# Altium schematic sheet I_DC_Buffering.SchDoc
size A4
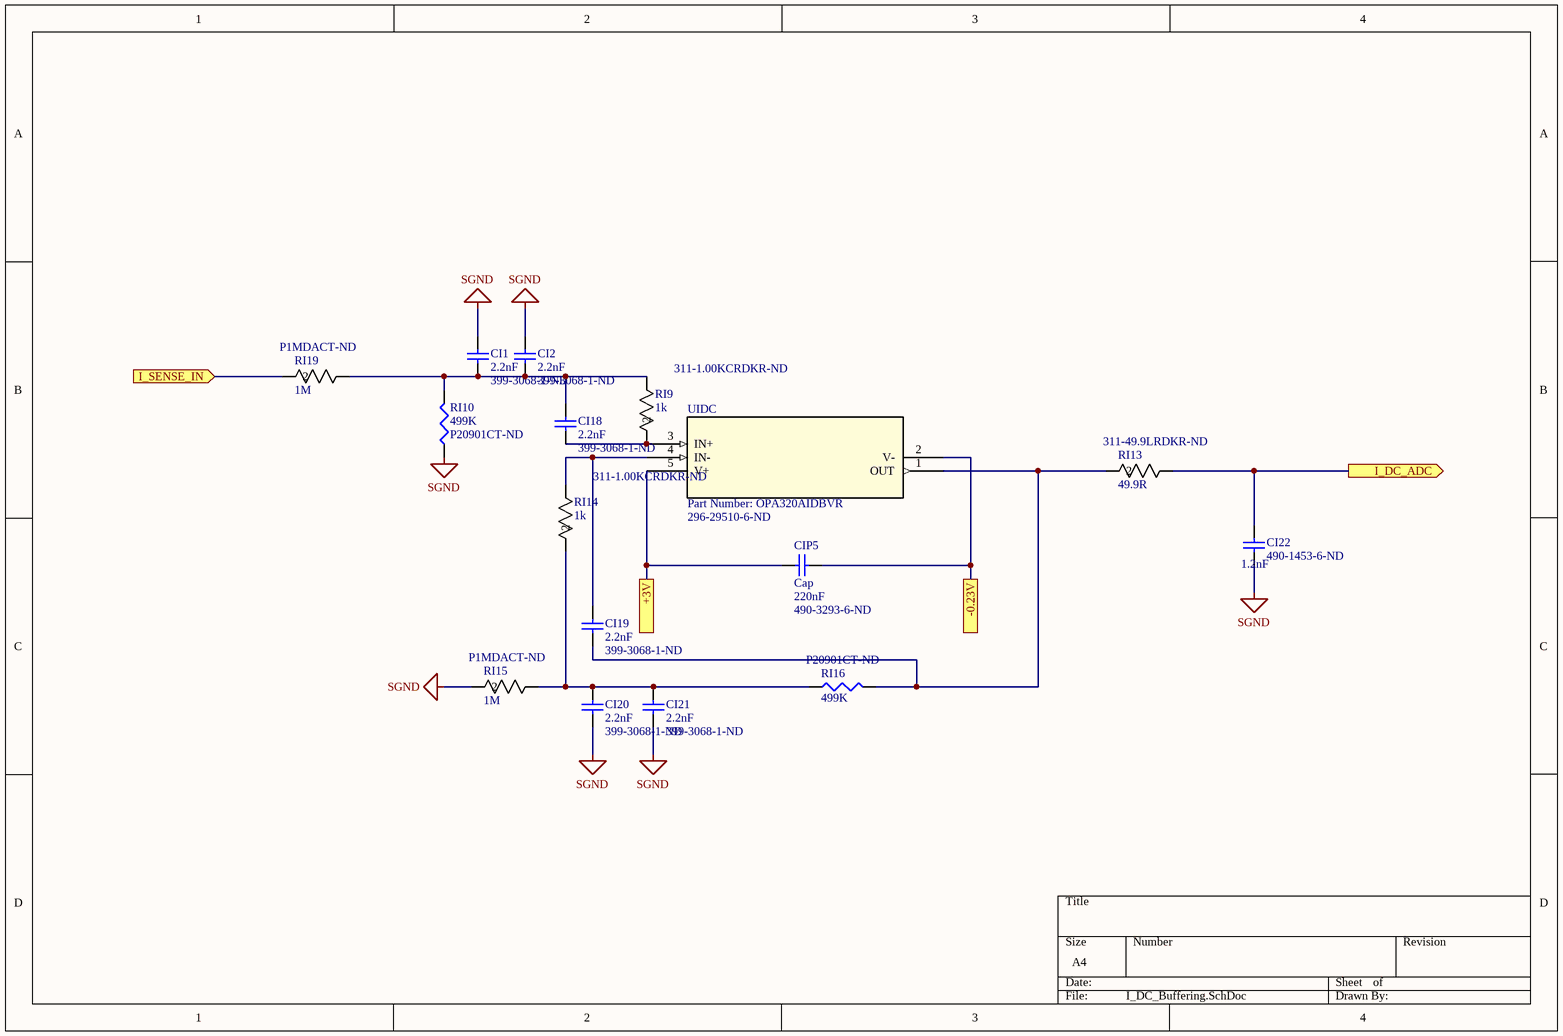
[diagram p0: I_DC_Buffering.SchDoc]

## Parts
CI1  2.2nF  Supplier Part Number 1: 399-3068-1-ND  [0402]
CI2  2.2nF  Supplier Part Number 1: 399-3068-1-ND  [0402]
CI18  2.2nF  Supplier Part Number 1: 399-3068-1-ND  [0402]
CI19  2.2nF  Supplier Part Number 1: 399-3068-1-ND  [0402]
CI20  2.2nF  Supplier Part Number 1: 399-3068-1-ND  [0402]
CI21  2.2nF  Supplier Part Number 1: 399-3068-1-ND  [0402]
CI22  1.2nF  Supplier Part Number 1: 490-1453-6-ND  [G-188]
CIP5  Cap  value 220nF  Supplier Part Number 1: 490-3293-6-ND  [G-188]
RI9  1k  Supplier Part Number 1: 311-1.00KCRDKR-ND  [RC0805N]
RI10  499K  Supplier Part Number 1: P20901CT-ND  [6-0805_N]
RI13  49.9R  Supplier Part Number 1: 311-49.9LRDKR-ND  [RC0402N]
RI14  1k  Supplier Part Number 1: 311-1.00KCRDKR-ND  [RC0805N]
RI15  1M  Supplier Part Number 1: P1MDACT-ND  [RC0805N]
RI16  499K  Supplier Part Number 1: P20901CT-ND  [6-0805_N]
RI19  1M  Supplier Part Number 1: P1MDACT-ND  [RC0805N]
UIDC  Part Number: OPA320AIDBVR  Supplier Part Number 1: 296-29510-6-ND  [DBV5]

## Ports
+3V, -0.23V, I_DC_ADC (out), I_SENSE_IN (in)

## Nets
SGND: CI1.2 CI2.2 CI20.2 CI21.2 CI22.2 RI10.1 RI15.2
+3V: CIP5.2 UIDC.5(V+) ; port +3V
-0.23V: CIP5.1 UIDC.2(V-) ; port -0.23V
I_DC_ADC: CI22.1 RI13.1 ; port I_DC_ADC
I_SENSE_IN: RI19.2 ; port I_SENSE_IN
NetCI1_1: CI1.1 CI2.1 CI18.1 RI9.1 RI10.2 RI19.1
NetCI18_2: CI18.2 RI9.2 UIDC.3(IN+)
NetCI19_1: CI19.1 RI14.1 UIDC.4(IN-)
NetCI19_2: CI19.2 RI13.2 RI16.2 UIDC.1(OUT)
NetCI20_1: CI20.1 CI21.1 RI14.2 RI15.1 RI16.1

## Library data of the parts
CI1 CI2 CI18-CI21 = Cap Semi: Manufacturer: KEMET; Manufacturer Part Number: C0402C222K5RACTU; Dielectric Material: Ceramic; Tolerance: 10%; Dielectric: X7R; Voltage Rating (DC): 50V; Published: 8-Jun-2000; LatestRevisionDate: 29-May-2009; LatestRevisionNote: IPC-7351 Footprint Added.; PackageReference: C1206; Publisher: Altium Limited; PackageDescription: Chip Capacitor; Supplier 1: Digi-Key; Stock 1: 1736920; Pricing 1: 1=0.1, 10=0.033, 100=0.0147, 500=0.01046, 1000=0.00822, 2500=0.00748, 5000=0.00688 (USD); Mount: Surface Mount; Case/Package: 0402; Min Operating Temperature: -55°C; Max Operating Temperature: 125°C; Capacitance: 2.2nF; Packaging: Tape and Reel; Voltage: 50V; Termination: SMD/SMT; Length: 1mm; Height: 0.5mm; Depth: 0.5mm; Radiation Hardening: No; ComponentLink1URL: http://www.onlinecomponents.com/productFiles/mf-KEM/docfinderpartnumberc0402c102k5ractu.pdf?src-supplier=Onlinecomponents.com; ComponentLink1Description: http://www.onlinecomponents.com/productFiles/mf-KEM/docfinderpartnumberc0402c102k5ractu.pdf?src-supplier=Onlinecomponents.com
CI22 = 1004001100050: Manufacturer: Murata; Manufacturer Part Number: GRM1885C1H122JA01D; Tolerance: 5%; Dielectric: C0G; Voltage Rating: 50V; Temperature Coefficient: 30ppm/°C; ComponentLink1URL: https://www.murata.com/~/media/webrenewal/support/library/catalog/products/capacitor/mlcc/c02e.ashx?la=en-us&src-supplier=Digi-Key; ComponentLink1Description: https://www.murata.com/~/media/webrenewal/support/library/catalog/products/capacitor/mlcc/c02e.ashx?la=en-us&src-supplier=Digi-Key; ComponentLink2URL: http://www.farnell.com/datasheets/608985.pdf?src-supplier=Element14; ComponentLink2Description: http://www.farnell.com/datasheets/608985.pdf?src-supplier=Element14; ComponentLink3URL: http://www.farnell.com/datasheets/2048707.pdf?src-supplier=Element14; ComponentLink3Description: http://www.farnell.com/datasheets/2048707.pdf?src-supplier=Element14; ComponentLink4URL: http://psearch.murata.com/capacitor/product/GRM188R71C223KA01%23.pdf?src-supplier=Future+Electronics; ComponentLink4Description: http://psearch.murata.com/capacitor/product/GRM188R71C223KA01%23.pdf?src-supplier=Future+Electronics; ComponentLink5URL: http://www.farnell.com/datasheets/2048707.pdf?src-supplier=Verical; ComponentLink5Description: http://www.farnell.com/datasheets/2048707.pdf?src-supplier=Verical; Supplier 1: Digi-Key; Stock 1: 29983; Pricing 1: 1=0.13, 10=0.095, 100=0.0446, 500=0.03126, 1000=0.02589 (USD); Mount: Surface Mount; Case/Package: 0603; Case Code (Metric): 1608; Case Code (Imperial): 0603; Min Operating Temperature: -55°C; Max Operating Temperature: 125°C; Capacitance: 1.2nF; Package Quantity: 1; Packaging: Tape and Reel; Termination: SMD/SMT; Voltage: 50V; Voltage Rating (DC): 50V; Length: 1.6mm; Height: 0.8mm; Width: 0.031inch; Thickness: 0.035inch; Depth: 0.8mm; Radiation Hardening: No; REACH SVHC: No SVHC; Lead Free: Lead Free; ComponentLink6URL: http://psearch.murata.com/capacitor/product/GRM1885C1H122JA01%23.pdf?src-supplier=Future+Electronics; ComponentLink6Description: http://psearch.murata.com/capacitor/product/GRM1885C1H122JA01%23.pdf?src-supplier=Future+Electronics; ComponentLink7URL: http://psearch.en.murata.com/capacitor/product/GRM1885C1H122JA01%23.pdf?src-supplier=Avnet; ComponentLink7Description: http://psearch.en.murata.com/capacitor/product/GRM1885C1H122JA01%23.pdf?src-supplier=Avnet; ComponentLink8URL: https://www.verical.com/server-webapp/html/getDatasheet?partID=56014&src-supplier=Verical; ComponentLink8Description: https://www.verical.com/server-webapp/html/getDatasheet?partID=56014&src-supplier=Verical
CIP5 = Cap: Capacitor; Manufacturer: Murata; Manufacturer Part Number: GRM188R71C224KA01D; Tolerance: 10%; Voltage Rating: 16V; Dielectric: X7R; Published: 8-Jun-2000; LatestRevisionDate: 17-Jul-2002; LatestRevisionNote: Re-released for DXP Platform.; PackageReference: RAD-0.3; Publisher: Altium Limited; PackageDescription: Radial Cap, Thru-Hole; 2 Leads; 0.3 in Pin Spacing; Supplier 1: Digi-Key; Stock 1: 363677; Pricing 1: 1=0.17, 10=0.116, 100=0.0586, 500=0.04006, 1000=0.03544 (USD); Mount: Surface Mount; Case/Package: 0603; Number of Pins: 2; Case Code (Metric): 1608; Case Code (Imperial): 0603; Min Operating Temperature: -55°C; Max Operating Temperature: 125°C; Packaging: Tape and Reel; Capacitance: 220nF; Package Quantity: 1; Voltage Rating (DC): 16V; Termination: SMD/SMT; Voltage: 16V; Length: 1.6mm; Height: 0.8mm; Width: 0.031inch; Thickness: 0.035inch; Depth: 0.8mm; Radiation Hardening: No; REACH SVHC: No SVHC; Lead Free: Lead Free; ComponentLink1URL: https://www.murata.com/~/media/webrenewal/support/library/catalog/products/capacitor/mlcc/c02e.ashx?la=en-us&src-supplier=Digi-Key; ComponentLink1Description: https://www.murata.com/~/media/webrenewal/support/library/catalog/products/capacitor/mlcc/c02e.ashx?la=en-us&src-supplier=Digi-Key; ComponentLink2URL: http://www.farnell.com/datasheets/608985.pdf?src-supplier=Element14; ComponentLink2Description: http://www.farnell.com/datasheets/608985.pdf?src-supplier=Element14; ComponentLink3URL: http://www.farnell.com/datasheets/2048707.pdf?src-supplier=Element14; ComponentLink3Description: http://www.farnell.com/datasheets/2048707.pdf?src-supplier=Element14; ComponentLink4URL: http://psearch.murata.com/capacitor/product/GRM188R71C223KA01%23.pdf?src-supplier=Future+Electronics; ComponentLink4Description: http://psearch.murata.com/capacitor/product/GRM188R71C223KA01%23.pdf?src-supplier=Future+Electronics; ComponentLink5URL: http://www.farnell.com/datasheets/2048707.pdf?src-supplier=Verical; ComponentLink5Description: http://www.farnell.com/datasheets/2048707.pdf?src-supplier=Verical
RI9 RI14 = RC0805FR-071KL: No Description Available; Vendor: Yageo; Built_By: EMA_UL_Team; Tolerance: 1%; Resistance: 1kR; Temperature Coefficient: 100ppm/°C; Voltage Rating (DC): 150V; Power Rating: 125mW; Manufacturer_Part_Number: RC0805FR-071KL; Copyright: Copyright (C) 2018 Accelerated Designs. All rights reserved; RefDes: RefDes; Type: DEV; Value: Value; Supplier 1: Digi-Key; Manufacturer: Yageo; Manufacturer Part Number: RC0805FR-071KL; Stock 1: 25065297; Pricing 1: 1=0.1, 10=0.04, 100=0.0163, 1000=0.00731, 2500=0.00635 (USD); Case/Package: 0805; Number of Pins: 2; Case Code (Metric): 2012; Case Code (Imperial): 0805; Min Operating Temperature: -55°C; Max Operating Temperature: 155°C; Packaging: Tape and Reel; Composition: Thick Film; Package Quantity: 1; Voltage Rating: 150V; Number of Terminations: 2; Termination: SMD/SMT; Military Standard: Not; Max Power Dissipation: 125mW; Features: Moisture Resistant; Length: 0.079inch; Height: 0.024inch; Width: 0.049inch; Depth: 1.25mm; REACH SVHC: Unknown; Lead Free: Lead Free; ComponentLink1URL: http://www.yageo.com/documents/recent/PYu-RC_Group_51_RoHS_L_10.pdf?src-supplier=Digi-Key; ComponentLink1Description: http://www.yageo.com/documents/recent/PYu-RC_Group_51_RoHS_L_10.pdf?src-supplier=Digi-Key; ComponentLink2URL: http://www.farnell.com/datasheets/1686128.pdf?src-supplier=Element14; ComponentLink2Description: http://www.farnell.com/datasheets/1686128.pdf?src-supplier=Element14; ComponentLink3URL: http://www.yageo.ru/pdf/RC0805.pdf?src-supplier=Future+Electronics; ComponentLink3Description: http://www.yageo.ru/pdf/RC0805.pdf?src-supplier=Future+Electronics; ComponentLink4URL: http://www.farnell.com/datasheets/2167052.pdf?src-supplier=Element14; ComponentLink4Description: http://www.farnell.com/datasheets/2167052.pdf?src-supplier=Element14
RI10 RI16 = Res3: Resistor; Manufacturer: Panasonic; Manufacturer Part Number: ERJ-PB6B4993V; Resistance: 499kR; Tolerance: 0.1%; Max Power Dissipation: 250mW; Temperature Coefficient: 50ppm/°C; Published: 8-Jun-2000; LatestRevisionDate: 29-May-2009; LatestRevisionNote: IPC-7351 Footprint Added.; PackageReference: J1-0603; Publisher: Altium Limited; PackageDescription: Chip Resistor; Supplier 1: Digi-Key; Stock 1: 6670; Pricing 1: 1=0.36, 10=0.306, 25=0.2228, 50=0.1614, 100=0.1197, 250=0.09184, 500=0.07236, 1000=0.05009 (USD); Case/Package: 0805; Case Code (Metric): 2012; Case Code (Imperial): 0805; Min Operating Temperature: -55°C; Max Operating Temperature: 155°C; Packaging: Tape and Reel; Composition: Thick Film; Number of Terminations: 2; Features: Automotive AEC-Q200; Length: 0.079inch; Width: 0.049inch; Height - Seated (Max): 0.028inch; ComponentLink1URL: https://industrial.panasonic.com/sa/system/files/data/download/catalog/id_fixed-resistors_e_2.pdf?src-supplier=Digi-Key; ComponentLink1Description: https://industrial.panasonic.com/sa/system/files/data/download/catalog/id_fixed-resistors_e_2.pdf?src-supplier=Digi-Key
RI13 = RC0402FR-0749R9L: No Description Available; Vendor: Yageo; Built_By: EMA_UL_Team; Tolerance: 1%; Power Rating: 62.5mW; Voltage Rating: 50V; Temperature Coefficient: 100ppm/°C; Max Power Dissipation: 63mW; Manufacturer_Part_Number: RC0402FR-0749R9L; Copyright: Copyright (C) 2018 Accelerated Designs. All rights reserved; RefDes: RefDes; Type: DEV; Value: Value; Supplier 1: Digi-Key; Manufacturer: Yageo; Manufacturer Part Number: RC0402FR-0749R9L; Stock 1: 14198932; Pricing 1: 1=0.1, 10=0.016, 100=0.0064, 1000=0.00289, 2500=0.00251, 5000=0.00207 (USD); Case/Package: 0402; Number of Pins: 2; Case Code (Imperial): 0402; Case Code (Metric): 1005; Min Operating Temperature: -55°C; Max Operating Temperature: 155°C; Packaging: Tape and Reel; Resistance: 49.9R; Package Quantity: 1; Termination: SMD/SMT; Composition: Thick Film; Number of Terminations: 2; Military Standard: Not; Voltage Rating (DC): 50V; Working Voltage: 50V; Features: Moisture Resistant; Length: 1mm; Height: 0.016inch; Width: 0.5mm; Depth: 0.5mm; REACH SVHC: No SVHC; Lead Free: Lead Free; ComponentLink1URL: http://documents.rs-components.com/techlib://itc_doclist_GB.htm?stockno=6184536&src-supplier=RSComponents; ComponentLink1Description: http://documents.rs-components.com/techlib://itc_doclist_GB.htm?stockno=6184536&src-supplier=RSComponents; ComponentLink2URL: http://www.farnell.com/datasheets/2167052.pdf?src-supplier=Element14; ComponentLink2Description: http://www.farnell.com/datasheets/2167052.pdf?src-supplier=Element14; ComponentLink3URL: http://www.yageo.com/documents/recent/PYu-RC0402_51_RoHS_L_6_r.pdf?src-supplier=Future+Electronics; ComponentLink3Description: http://www.yageo.com/documents/recent/PYu-RC0402_51_RoHS_L_6_r.pdf?src-supplier=Future+Electronics; ComponentLink4URL: http://www.yageo.com/documents/recent/PYu-RC_Group_51_RoHS_L_10.pdf?src-supplier=Digi-Key; ComponentLink4Description: http://www.yageo.com/documents/recent/PYu-RC_Group_51_RoHS_L_10.pdf?src-supplier=Digi-Key
RI15 RI19 = ERA-6AEB105V: No Description Available; Vendor: Panasonic; Built_By: EMA_UL_Team; Resistance: 1MR; Temperature Coefficient: 25ppm/°C; Voltage Rating: 100V; Power Rating: 125mW; Manufacturer_Part_Number: ERA-6AEB105V; Copyright: Copyright (C) 2018 Accelerated Designs. All rights reserved; RefDes: RefDes; Type: DEV; Value: Value; Supplier 1: Digi-Key; Manufacturer: Panasonic; Manufacturer Part Number: ERA-6AEB105V; Stock 1: 223782; Pricing 1: 1=0.34, 10=0.288, 100=0.1126, 1000=0.04712, 2500=0.0432 (USD); Mount: Surface Mount; Case/Package: 0805; Number of Pins: 2; Contact Plating: Tin; Case Code (Imperial): 0805; Case Code (Metric): 2012; Min Operating Temperature: -55°C; Max Operating Temperature: 155°C; Composition: Thin Film; Packaging: Tape and Reel; Package Quantity: 1; Number of Terminations: 2; Military Standard: Not; Termination: Solder; Max Power Dissipation: 125mW; Voltage Rating (DC): 100V; Working Voltage: 100V; Features: Automotive AEC-Q200; Length: 2mm; Height: 0.5mm; Width: 1.25mm; Depth: 1.25mm; Radiation Hardening: No; REACH SVHC: No SVHC; Lead Free: Lead Free; ComponentLink1URL: http://uk.rs-online.com/webdocs/0bee/0900766b80beefcc.pdf?src-supplier=RSComponents; ComponentLink1Description: http://uk.rs-online.com/webdocs/0bee/0900766b80beefcc.pdf?src-supplier=RSComponents; ComponentLink2URL: http://www.farnell.com/datasheets/485442.pdf?src-supplier=Element14; ComponentLink2Description: http://www.farnell.com/datasheets/485442.pdf?src-supplier=Element14; ComponentLink3URL: https://industrial.panasonic.com/cdbs/www-data/pdf/RDM0000/AOA0000C307.pdf?src-supplier=Future+Electronics; ComponentLink3Description: https://industrial.panasonic.com/cdbs/www-data/pdf/RDM0000/AOA0000C307.pdf?src-supplier=Future+Electronics; ComponentLink4URL: http://www.farnell.com/datasheets/2052875.pdf?src-supplier=Farnell; ComponentLink4Description: http://www.farnell.com/datasheets/2052875.pdf?src-supplier=Farnell; ComponentLink5URL: http://industrial.panasonic.com/www-data/pdf/AOA0000/AOA0000CE26.pdf?src-supplier=Avnet; ComponentLink5Description: http://industrial.panasonic.com/www-data/pdf/AOA0000/AOA0000CE26.pdf?src-supplier=Avnet; ComponentLink6URL: http://www.alliedelec.com/m/d/b6b0537e86f421aa7f5975bb1d8f429a.pdf?src-supplier=Allied+Electronics; ComponentLink6Description: http://www.alliedelec.com/m/d/b6b0537e86f421aa7f5975bb1d8f429a.pdf?src-supplier=Allied+Electronics; ComponentLink7URL: http://www.farnell.com/datasheets/485442.pdf?src-supplier=Farnell; ComponentLink7Description: http://www.farnell.com/datasheets/485442.pdf?src-supplier=Farnell; ComponentLink8URL: http://industrial.panasonic.com/www-data/pdf/AOA0000/AOA0000CE26.pdf?src-supplier=Avnet+Europe; ComponentLink8Description: http://industrial.panasonic.com/www-data/pdf/AOA0000/AOA0000CE26.pdf?src-supplier=Avnet+Europe; ComponentLink9URL: http://www.produktinfo.conrad.com/datenblaetter/450000-474999/458432-da-01-en-WIDERSTAND_0805_ERA.pdf?src-supplier=Conrad; ComponentLink9Description: http://www.produktinfo.conrad.com/datenblaetter/450000-474999/458432-da-01-en-WIDERSTAND_0805_ERA.pdf?src-supplier=Conrad
UIDC = OPA320SAIDBVR: No Description Available; Manufacturer: Texas Instruments; Manufacturer Part Number: OPA320AIDBVT; Description: TEXAS INSTRUMENTS - OPA320AIDBVT - Operational Amplifier, 1 Amplifier, 20 MHz, 10 V/µs, 1.8V to 5.5V, SOT-23, 5 Pins; Gain Bandwidth Product: 20MHz; Min Supply Voltage: 1.8V; Max Supply Voltage: 5.5V; Min Dual Supply Voltage: 900mV; Max Dual Supply Voltage: 2.75V; Voltage Gain: 132dB; Common Mode Rejection Ratio: 100dB; Number of Channels: 1; Slew Rate: 10V/µs; Input Bias Current: 0.9pA; Input Offset Voltage (Vos): 150uV; Operating Supply Current: 1.5mA; Output Current per Channel: 65mA; Nominal Supply Current: 1.45mA; Power Supply Rejection Ratio (PSRR): 106.02dB; Max Frequency: 1MHz; ComponentLink1URL: http://www.mouser.com/ds/2/405/opa320-372960.pdf?src-supplier=Mouser; ComponentLink1Description: http://www.mouser.com/ds/2/405/opa320-372960.pdf?src-supplier=Mouser; ComponentLink2URL: http://www.ti.com/lit/ds/symlink/opa320.pdf?src-supplier=Digi-Key; ComponentLink2Description: http://www.ti.com/lit/ds/symlink/opa320.pdf?src-supplier=Digi-Key; Supplier 1: Digi-Key; Stock 1: 2996; Pricing 1: 1=2.39, 10=2.147, 25=2.0252, 100=1.62 (USD); Case/Package: SOT-23; Number of Pins: 5; Contact Plating: Gold; Min Operating Temperature: -40°C; Max Operating Temperature: 125°C; Packaging: Tape and Reel; Number of Circuits: 1; Package Quantity: 1; Unity Gain Bandwidth Product: 20MHz; Number of Elements: 1; Output Current: 65mA; Bandwidth: 20MHz; Operating Supply Voltage: 2.75V; Max I/O Voltage: 150uV; Number of Amplifiers: 1; Length: 3.05mm; Height: 1.3mm; Width: 1.75mm; Radiation Hardening: No; Lead Free: Lead Free; REACH SVHC: No SVHC; ComponentLink3URL: http://www.farnell.com/datasheets/2018960.pdf?src-supplier=Element14; ComponentLink3Description: http://www.farnell.com/datasheets/2018960.pdf?src-supplier=Element14; ComponentLink4URL: http://www.ti.com/general/docs/lit/getliterature.tsp?genericPartNumber=OPA320&fileType=pdf&src-supplier=Newark; ComponentLink4Description: http://www.ti.com/general/docs/lit/getliterature.tsp?genericPartNumber=OPA320&fileType=pdf&src-supplier=Newark